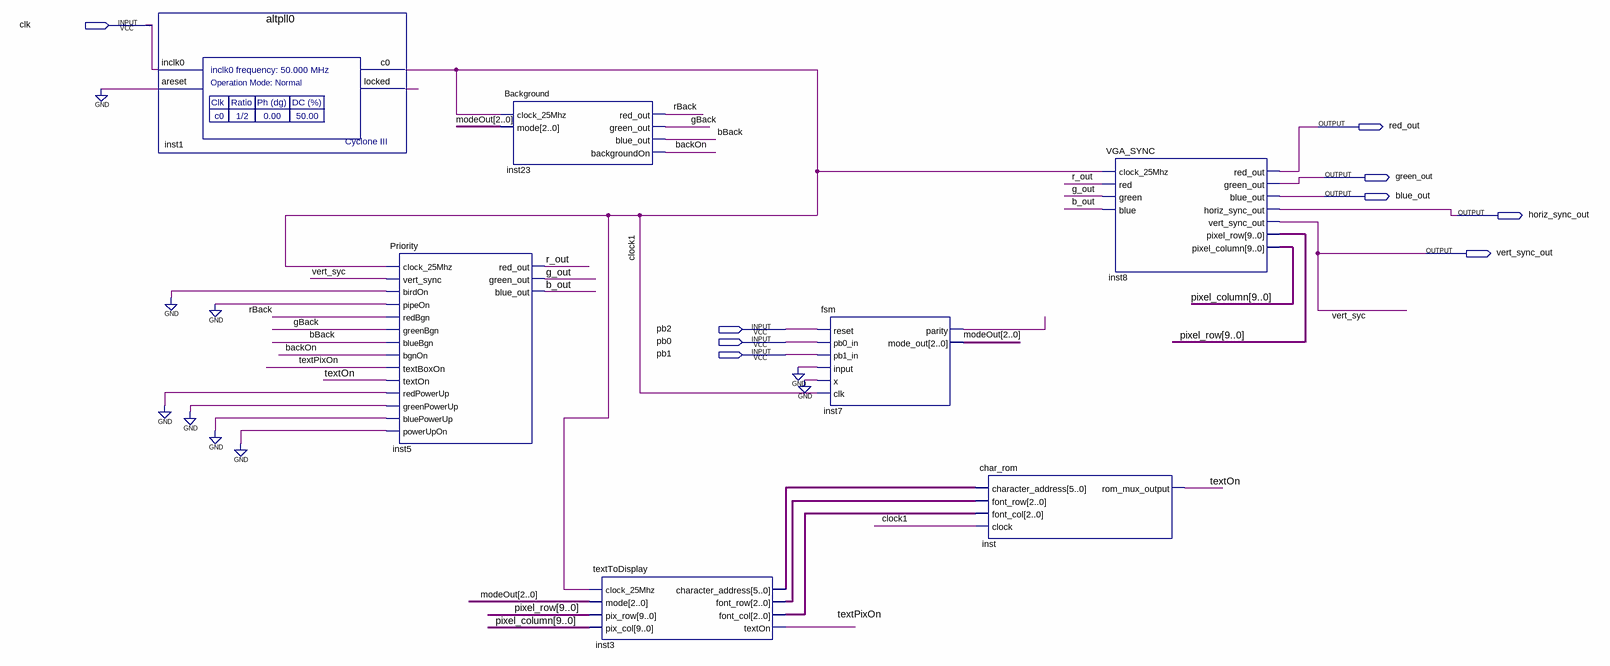
[diagram p0: schematic sheet]
// Quartus schematic FSMandBackground.bdf as structural Verilog: 7 symbols, 9 pins
module FSMandBackground (
  input  clk,
  input  pb2,
  input  pb0,
  input  pb1,
  output red_out,
  output green_out,
  output blue_out,
  output horiz_sync_out,
  output vert_sync_out
);

  wire b_out, backOn, bBack, clock1, g_out, gBack, inst1_locked, inst7_parity, r_out, rBack, textOn,
       textPixOn;
  wire [2:0] inst3_font_col, inst3_font_row, modeOut;
  wire [5:0] inst3_character_address;
  wire [9:0] pixel_column, pixel_row;

  altpll0 inst1 (.inclk0(clk), .areset(1'b0), .c0(clock1), .locked(inst1_locked));
  Priority inst5 (
    .clock_25Mhz(clock1), .vert_sync(vert_sync_out), .birdOn(1'b0), .pipeOn(1'b0), .redBgn(rBack),
    .greenBgn(gBack), .blueBgn(bBack), .bgnOn(backOn), .textBoxOn(textPixOn), .textOn(textOn),
    .redPowerUp(1'b0), .greenPowerUp(1'b0), .bluePowerUp(1'b0), .powerUpOn(1'b0), .red_out(r_out),
    .green_out(g_out), .blue_out(b_out));
  Background inst23 (
    .clock_25Mhz(clock1), .mode(modeOut), .red_out(rBack), .green_out(gBack), .blue_out(bBack),
    .backgroundOn(backOn));
  textToDisplay inst3 (
    .clock_25Mhz(clock1), .mode(modeOut), .pix_row(pixel_row), .pix_col(pixel_column),
    .character_address(inst3_character_address), .font_row(inst3_font_row), .font_col(inst3_font_col),
    .textOn(textPixOn));
  fsm inst7 (
    .reset(pb2), .pb0_in(pb0), .pb1_in(pb1), .\input (1'b0), .x(1'b0), .clk(clock1), .parity(inst7_parity),
    .mode_out(modeOut));
  char_rom inst (
    .character_address(inst3_character_address), .font_row(inst3_font_row), .font_col(inst3_font_col),
    .clock(clock1), .rom_mux_output(textOn));
  VGA_SYNC inst8 (
    .clock_25Mhz(clock1), .red(r_out), .green(g_out), .blue(b_out), .red_out(red_out), .green_out(green_out),
    .blue_out(blue_out), .horiz_sync_out(horiz_sync_out), .vert_sync_out(vert_sync_out),
    .pixel_row(pixel_row), .pixel_column(pixel_column));

  // Other names for the same wires on the sheet: vert_syc = vert_sync_out
endmodule
